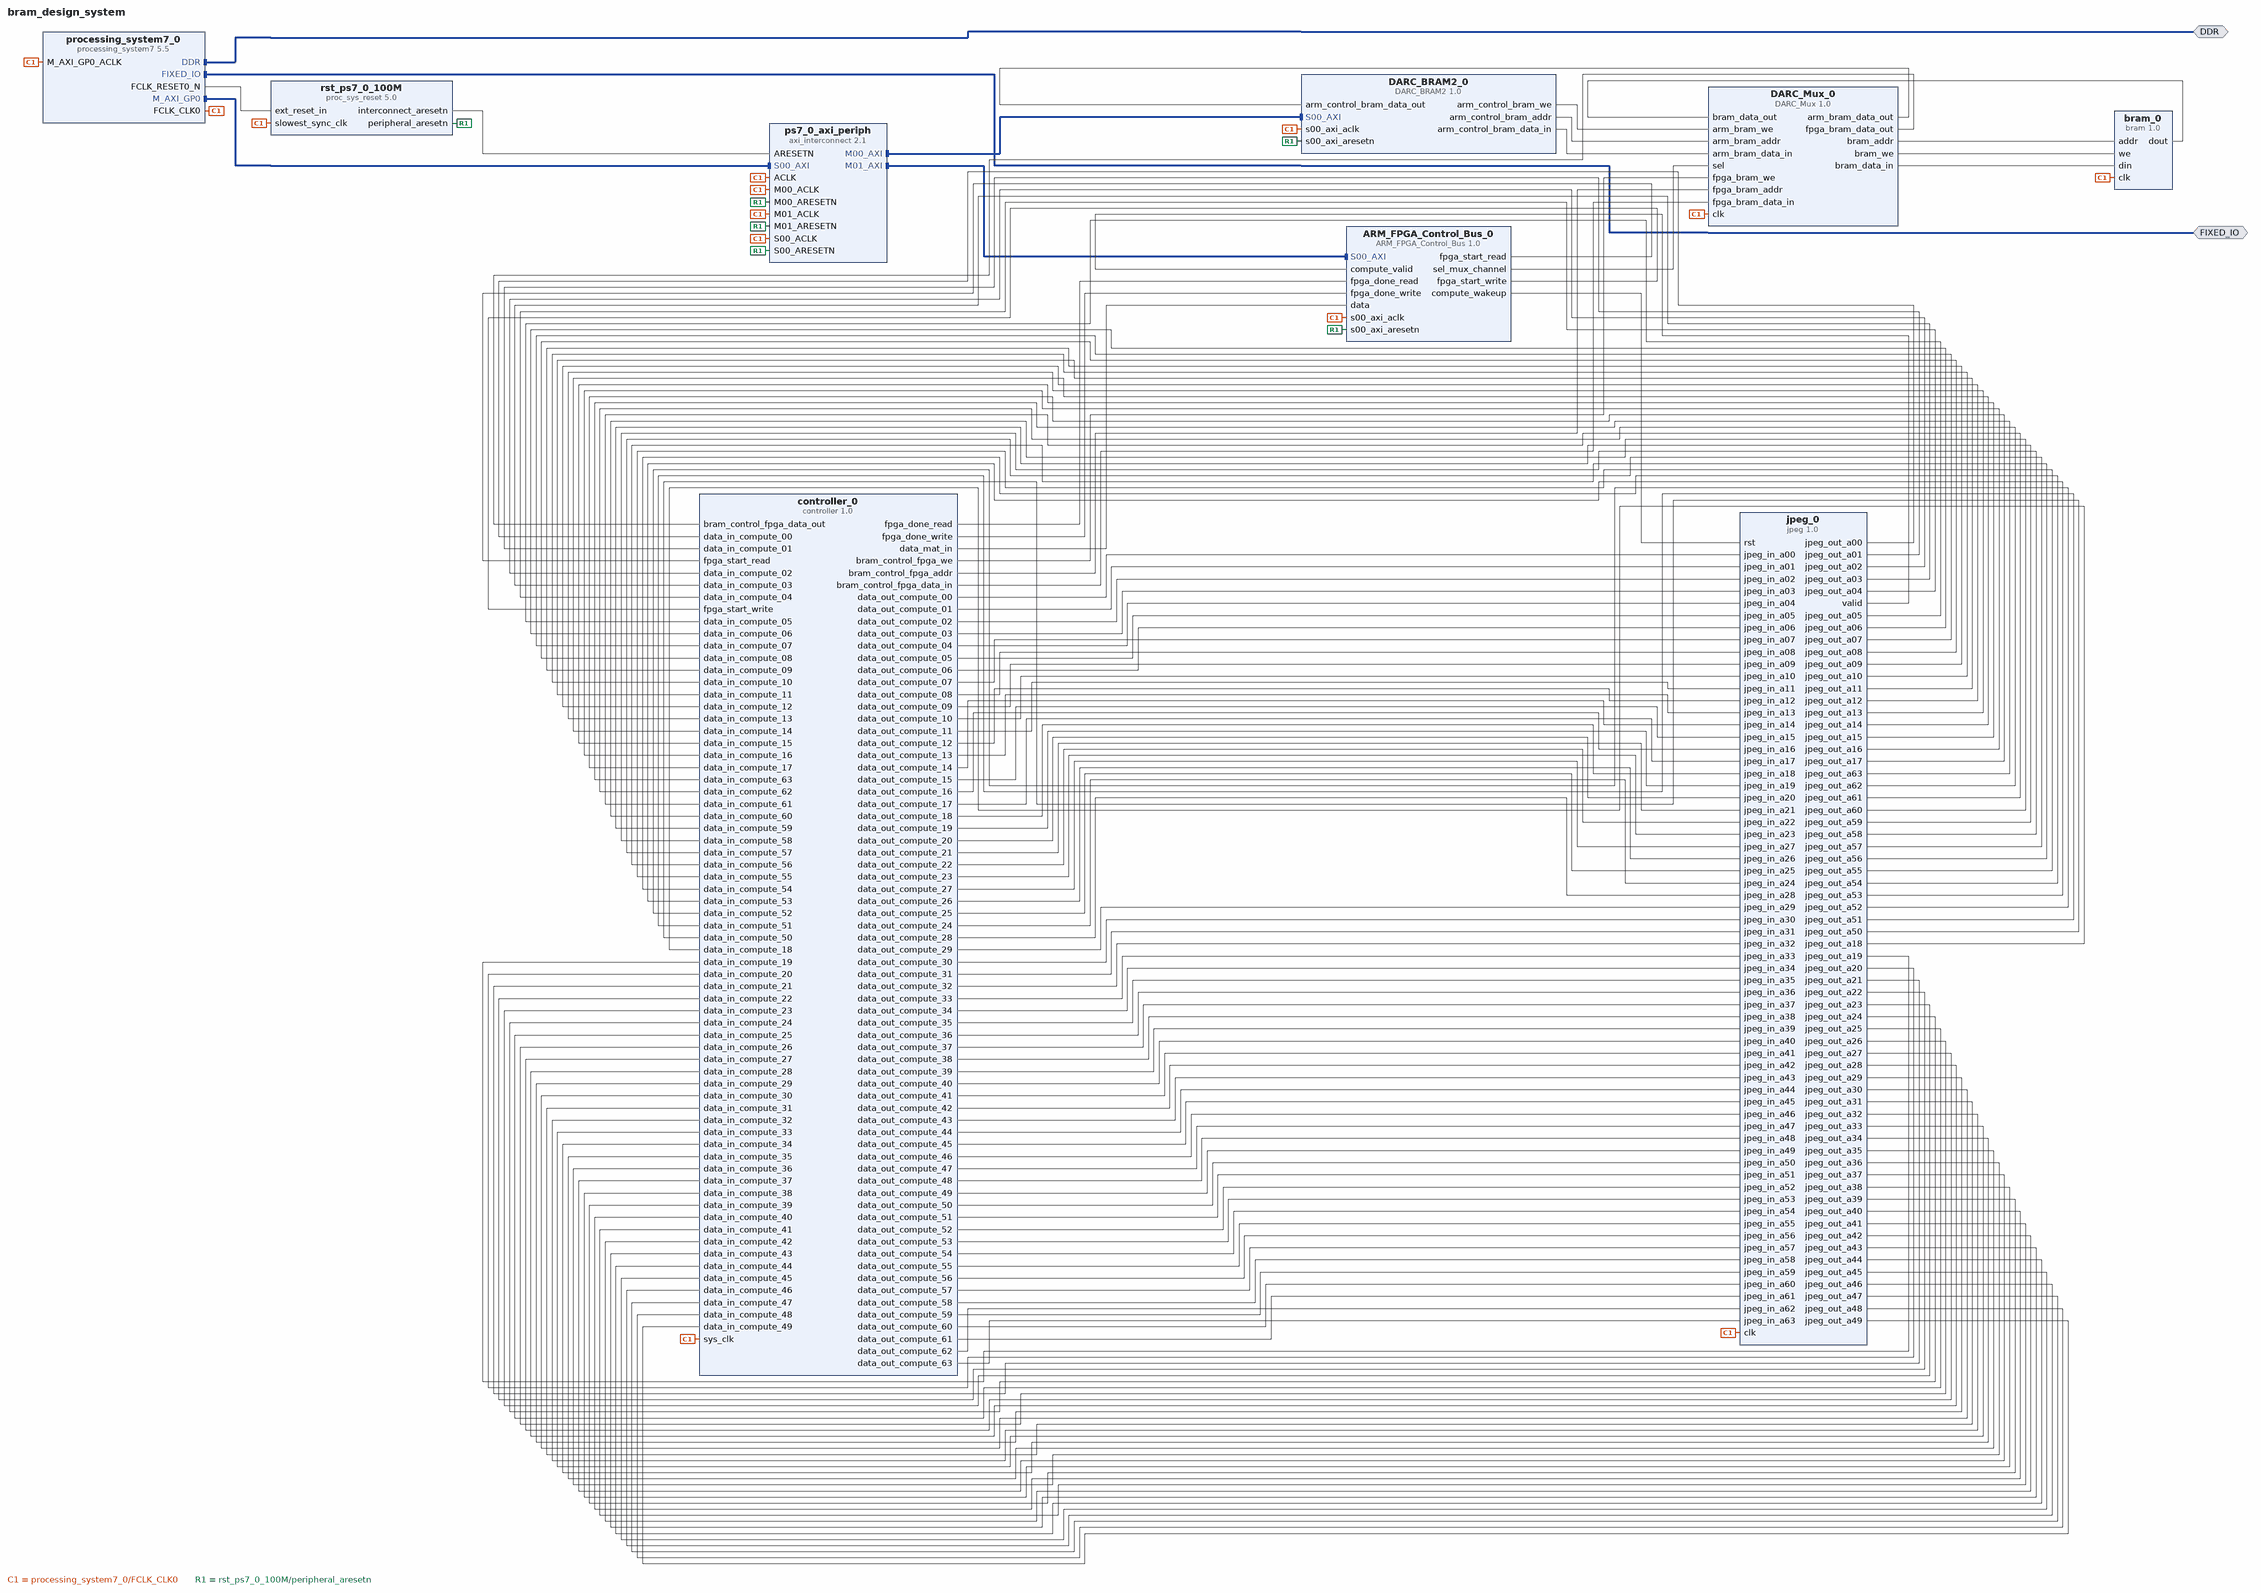
[diagram p0: block diagram of the top level]
# Vivado block design bram_design_system, xc7z020clg484-1, Vivado 2016.3
create_bd_design bram_design_system

create_bd_intf_port -mode Master -vlnv xilinx.com:interface:ddrx_rtl:1.0 DDR
create_bd_intf_port -mode Master -vlnv xilinx.com:display_processing_system7:fixedio_rtl:1.0 FIXED_IO

create_bd_cell -type ip -vlnv xilinx.com:ip:processing_system7:5.5 processing_system7_0
set_property -dict {CONFIG.PCW_FPGA0_PERIPHERAL_FREQMHZ 50 CONFIG.preset ZedBoard} [get_bd_cells processing_system7_0]
create_bd_cell -type ip -vlnv xilinx.com:ip:axi_interconnect:2.1 ps7_0_axi_periph
set_property -dict {CONFIG.NUM_MI 2} [get_bd_cells ps7_0_axi_periph]
create_bd_cell -type ip -vlnv xilinx.com:ip:proc_sys_reset:5.0 rst_ps7_0_100M
create_bd_cell -type ip -vlnv xilinx.com:user:DARC_BRAM2:1.0 DARC_BRAM2_0
create_bd_cell -type ip -vlnv xilinx.com:user:DARC_Mux:1.0 DARC_Mux_0
create_bd_cell -type ip -vlnv xilinx.com:user:bram:1.0 bram_0
create_bd_cell -type ip -vlnv xilinx.com:user:controller:1.0 controller_0
create_bd_cell -type ip -vlnv xilinx.com:user:jpeg:1.0 jpeg_0
create_bd_cell -type ip -vlnv xilinx.com:user:ARM_FPGA_Control_Bus:1.0 ARM_FPGA_Control_Bus_0

# ---- connections ----

connect_bd_intf_net [get_bd_intf_pins processing_system7_0/M_AXI_GP0] [get_bd_intf_pins ps7_0_axi_periph/S00_AXI]
connect_bd_intf_net [get_bd_intf_pins ps7_0_axi_periph/M00_AXI] [get_bd_intf_pins DARC_BRAM2_0/S00_AXI]
connect_bd_intf_net [get_bd_intf_pins ps7_0_axi_periph/M01_AXI] [get_bd_intf_pins ARM_FPGA_Control_Bus_0/S00_AXI]
connect_bd_intf_net [get_bd_intf_ports DDR] [get_bd_intf_pins processing_system7_0/DDR]
connect_bd_intf_net [get_bd_intf_ports FIXED_IO] [get_bd_intf_pins processing_system7_0/FIXED_IO]
connect_bd_net [get_bd_pins processing_system7_0/FCLK_CLK0] \
  [get_bd_pins processing_system7_0/M_AXI_GP0_ACLK] [get_bd_pins rst_ps7_0_100M/slowest_sync_clk] \
  [get_bd_pins DARC_BRAM2_0/s00_axi_aclk] [get_bd_pins DARC_Mux_0/clk] [get_bd_pins bram_0/clk] \
  [get_bd_pins ps7_0_axi_periph/S00_ACLK] [get_bd_pins ps7_0_axi_periph/ACLK] [get_bd_pins ps7_0_axi_periph/M00_ACLK] \
  [get_bd_pins ps7_0_axi_periph/M01_ACLK] [get_bd_pins controller_0/sys_clk] [get_bd_pins jpeg_0/clk] \
  [get_bd_pins ARM_FPGA_Control_Bus_0/s00_axi_aclk]
connect_bd_net [get_bd_pins processing_system7_0/FCLK_RESET0_N] [get_bd_pins rst_ps7_0_100M/ext_reset_in]
connect_bd_net [get_bd_pins rst_ps7_0_100M/peripheral_aresetn] \
  [get_bd_pins DARC_BRAM2_0/s00_axi_aresetn] [get_bd_pins ps7_0_axi_periph/S00_ARESETN] \
  [get_bd_pins ps7_0_axi_periph/M00_ARESETN] [get_bd_pins ps7_0_axi_periph/M01_ARESETN] \
  [get_bd_pins ARM_FPGA_Control_Bus_0/s00_axi_aresetn]
connect_bd_net [get_bd_pins rst_ps7_0_100M/interconnect_aresetn] [get_bd_pins ps7_0_axi_periph/ARESETN]
connect_bd_net [get_bd_pins DARC_Mux_0/bram_addr] [get_bd_pins bram_0/addr]
connect_bd_net [get_bd_pins DARC_Mux_0/bram_we] [get_bd_pins bram_0/we]
connect_bd_net [get_bd_pins DARC_Mux_0/bram_data_in] [get_bd_pins bram_0/din]
connect_bd_net [get_bd_pins bram_0/dout] [get_bd_pins DARC_Mux_0/bram_data_out]
connect_bd_net [get_bd_pins DARC_Mux_0/arm_bram_data_out] [get_bd_pins DARC_BRAM2_0/arm_control_bram_data_out]
connect_bd_net [get_bd_pins DARC_BRAM2_0/arm_control_bram_we] [get_bd_pins DARC_Mux_0/arm_bram_we]
connect_bd_net [get_bd_pins DARC_BRAM2_0/arm_control_bram_addr] [get_bd_pins DARC_Mux_0/arm_bram_addr]
connect_bd_net [get_bd_pins DARC_BRAM2_0/arm_control_bram_data_in] [get_bd_pins DARC_Mux_0/arm_bram_data_in]
connect_bd_net [get_bd_pins ARM_FPGA_Control_Bus_0/sel_mux_channel] [get_bd_pins DARC_Mux_0/sel]
connect_bd_net [get_bd_pins controller_0/bram_control_fpga_we] [get_bd_pins DARC_Mux_0/fpga_bram_we]
connect_bd_net [get_bd_pins controller_0/bram_control_fpga_addr] [get_bd_pins DARC_Mux_0/fpga_bram_addr]
connect_bd_net [get_bd_pins controller_0/bram_control_fpga_data_in] [get_bd_pins DARC_Mux_0/fpga_bram_data_in]
connect_bd_net [get_bd_pins ARM_FPGA_Control_Bus_0/fpga_start_read] [get_bd_pins controller_0/fpga_start_read]
connect_bd_net [get_bd_pins ARM_FPGA_Control_Bus_0/fpga_start_write] [get_bd_pins controller_0/fpga_start_write]
connect_bd_net [get_bd_pins controller_0/fpga_done_read] [get_bd_pins ARM_FPGA_Control_Bus_0/fpga_done_read]
connect_bd_net [get_bd_pins controller_0/fpga_done_write] [get_bd_pins ARM_FPGA_Control_Bus_0/fpga_done_write]
connect_bd_net [get_bd_pins DARC_Mux_0/fpga_bram_data_out] [get_bd_pins controller_0/bram_control_fpga_data_out]
connect_bd_net [get_bd_pins controller_0/data_mat_in] [get_bd_pins ARM_FPGA_Control_Bus_0/data]
connect_bd_net [get_bd_pins controller_0/data_out_compute_00] [get_bd_pins jpeg_0/jpeg_in_a00]
connect_bd_net [get_bd_pins controller_0/data_out_compute_01] [get_bd_pins jpeg_0/jpeg_in_a01]
connect_bd_net [get_bd_pins controller_0/data_out_compute_02] [get_bd_pins jpeg_0/jpeg_in_a02]
connect_bd_net [get_bd_pins controller_0/data_out_compute_03] [get_bd_pins jpeg_0/jpeg_in_a03]
connect_bd_net [get_bd_pins controller_0/data_out_compute_04] [get_bd_pins jpeg_0/jpeg_in_a04]
connect_bd_net [get_bd_pins controller_0/data_out_compute_05] [get_bd_pins jpeg_0/jpeg_in_a05]
connect_bd_net [get_bd_pins controller_0/data_out_compute_06] [get_bd_pins jpeg_0/jpeg_in_a06]
connect_bd_net [get_bd_pins controller_0/data_out_compute_07] [get_bd_pins jpeg_0/jpeg_in_a07]
connect_bd_net [get_bd_pins controller_0/data_out_compute_08] [get_bd_pins jpeg_0/jpeg_in_a08]
connect_bd_net [get_bd_pins controller_0/data_out_compute_09] [get_bd_pins jpeg_0/jpeg_in_a09]
connect_bd_net [get_bd_pins controller_0/data_out_compute_10] [get_bd_pins jpeg_0/jpeg_in_a10]
connect_bd_net [get_bd_pins controller_0/data_out_compute_11] [get_bd_pins jpeg_0/jpeg_in_a11]
connect_bd_net [get_bd_pins controller_0/data_out_compute_12] [get_bd_pins jpeg_0/jpeg_in_a12]
connect_bd_net [get_bd_pins controller_0/data_out_compute_13] [get_bd_pins jpeg_0/jpeg_in_a13]
connect_bd_net [get_bd_pins controller_0/data_out_compute_14] [get_bd_pins jpeg_0/jpeg_in_a14]
connect_bd_net [get_bd_pins controller_0/data_out_compute_15] [get_bd_pins jpeg_0/jpeg_in_a15]
connect_bd_net [get_bd_pins controller_0/data_out_compute_16] [get_bd_pins jpeg_0/jpeg_in_a16]
connect_bd_net [get_bd_pins controller_0/data_out_compute_17] [get_bd_pins jpeg_0/jpeg_in_a17]
connect_bd_net [get_bd_pins controller_0/data_out_compute_18] [get_bd_pins jpeg_0/jpeg_in_a18]
connect_bd_net [get_bd_pins controller_0/data_out_compute_19] [get_bd_pins jpeg_0/jpeg_in_a19]
connect_bd_net [get_bd_pins controller_0/data_out_compute_20] [get_bd_pins jpeg_0/jpeg_in_a20]
connect_bd_net [get_bd_pins controller_0/data_out_compute_21] [get_bd_pins jpeg_0/jpeg_in_a21]
connect_bd_net [get_bd_pins controller_0/data_out_compute_22] [get_bd_pins jpeg_0/jpeg_in_a22]
connect_bd_net [get_bd_pins controller_0/data_out_compute_23] [get_bd_pins jpeg_0/jpeg_in_a23]
connect_bd_net [get_bd_pins controller_0/data_out_compute_27] [get_bd_pins jpeg_0/jpeg_in_a27]
connect_bd_net [get_bd_pins controller_0/data_out_compute_26] [get_bd_pins jpeg_0/jpeg_in_a26]
connect_bd_net [get_bd_pins controller_0/data_out_compute_25] [get_bd_pins jpeg_0/jpeg_in_a25]
connect_bd_net [get_bd_pins controller_0/data_out_compute_24] [get_bd_pins jpeg_0/jpeg_in_a24]
connect_bd_net [get_bd_pins controller_0/data_out_compute_28] [get_bd_pins jpeg_0/jpeg_in_a28]
connect_bd_net [get_bd_pins controller_0/data_out_compute_29] [get_bd_pins jpeg_0/jpeg_in_a29]
connect_bd_net [get_bd_pins controller_0/data_out_compute_30] [get_bd_pins jpeg_0/jpeg_in_a30]
connect_bd_net [get_bd_pins controller_0/data_out_compute_31] [get_bd_pins jpeg_0/jpeg_in_a31]
connect_bd_net [get_bd_pins controller_0/data_out_compute_32] [get_bd_pins jpeg_0/jpeg_in_a32]
connect_bd_net [get_bd_pins controller_0/data_out_compute_33] [get_bd_pins jpeg_0/jpeg_in_a33]
connect_bd_net [get_bd_pins controller_0/data_out_compute_34] [get_bd_pins jpeg_0/jpeg_in_a34]
connect_bd_net [get_bd_pins controller_0/data_out_compute_35] [get_bd_pins jpeg_0/jpeg_in_a35]
connect_bd_net [get_bd_pins controller_0/data_out_compute_36] [get_bd_pins jpeg_0/jpeg_in_a36]
connect_bd_net [get_bd_pins controller_0/data_out_compute_37] [get_bd_pins jpeg_0/jpeg_in_a37]
connect_bd_net [get_bd_pins controller_0/data_out_compute_38] [get_bd_pins jpeg_0/jpeg_in_a38]
connect_bd_net [get_bd_pins controller_0/data_out_compute_39] [get_bd_pins jpeg_0/jpeg_in_a39]
connect_bd_net [get_bd_pins controller_0/data_out_compute_40] [get_bd_pins jpeg_0/jpeg_in_a40]
connect_bd_net [get_bd_pins controller_0/data_out_compute_41] [get_bd_pins jpeg_0/jpeg_in_a41]
connect_bd_net [get_bd_pins controller_0/data_out_compute_42] [get_bd_pins jpeg_0/jpeg_in_a42]
connect_bd_net [get_bd_pins controller_0/data_out_compute_43] [get_bd_pins jpeg_0/jpeg_in_a43]
connect_bd_net [get_bd_pins controller_0/data_out_compute_44] [get_bd_pins jpeg_0/jpeg_in_a44]
connect_bd_net [get_bd_pins controller_0/data_out_compute_45] [get_bd_pins jpeg_0/jpeg_in_a45]
connect_bd_net [get_bd_pins controller_0/data_out_compute_46] [get_bd_pins jpeg_0/jpeg_in_a46]
connect_bd_net [get_bd_pins controller_0/data_out_compute_47] [get_bd_pins jpeg_0/jpeg_in_a47]
connect_bd_net [get_bd_pins controller_0/data_out_compute_48] [get_bd_pins jpeg_0/jpeg_in_a48]
connect_bd_net [get_bd_pins controller_0/data_out_compute_49] [get_bd_pins jpeg_0/jpeg_in_a49]
connect_bd_net [get_bd_pins controller_0/data_out_compute_50] [get_bd_pins jpeg_0/jpeg_in_a50]
connect_bd_net [get_bd_pins controller_0/data_out_compute_51] [get_bd_pins jpeg_0/jpeg_in_a51]
connect_bd_net [get_bd_pins controller_0/data_out_compute_52] [get_bd_pins jpeg_0/jpeg_in_a52]
connect_bd_net [get_bd_pins controller_0/data_out_compute_53] [get_bd_pins jpeg_0/jpeg_in_a53]
connect_bd_net [get_bd_pins controller_0/data_out_compute_54] [get_bd_pins jpeg_0/jpeg_in_a54]
connect_bd_net [get_bd_pins controller_0/data_out_compute_55] [get_bd_pins jpeg_0/jpeg_in_a55]
connect_bd_net [get_bd_pins controller_0/data_out_compute_56] [get_bd_pins jpeg_0/jpeg_in_a56]
connect_bd_net [get_bd_pins controller_0/data_out_compute_57] [get_bd_pins jpeg_0/jpeg_in_a57]
connect_bd_net [get_bd_pins controller_0/data_out_compute_58] [get_bd_pins jpeg_0/jpeg_in_a58]
connect_bd_net [get_bd_pins controller_0/data_out_compute_59] [get_bd_pins jpeg_0/jpeg_in_a59]
connect_bd_net [get_bd_pins controller_0/data_out_compute_60] [get_bd_pins jpeg_0/jpeg_in_a60]
connect_bd_net [get_bd_pins controller_0/data_out_compute_61] [get_bd_pins jpeg_0/jpeg_in_a61]
connect_bd_net [get_bd_pins controller_0/data_out_compute_62] [get_bd_pins jpeg_0/jpeg_in_a62]
connect_bd_net [get_bd_pins controller_0/data_out_compute_63] [get_bd_pins jpeg_0/jpeg_in_a63]
connect_bd_net [get_bd_pins jpeg_0/valid] [get_bd_pins ARM_FPGA_Control_Bus_0/compute_valid]
connect_bd_net [get_bd_pins jpeg_0/jpeg_out_a00] [get_bd_pins controller_0/data_in_compute_00]
connect_bd_net [get_bd_pins jpeg_0/jpeg_out_a01] [get_bd_pins controller_0/data_in_compute_01]
connect_bd_net [get_bd_pins jpeg_0/jpeg_out_a02] [get_bd_pins controller_0/data_in_compute_02]
connect_bd_net [get_bd_pins jpeg_0/jpeg_out_a03] [get_bd_pins controller_0/data_in_compute_03]
connect_bd_net [get_bd_pins jpeg_0/jpeg_out_a04] [get_bd_pins controller_0/data_in_compute_04]
connect_bd_net [get_bd_pins jpeg_0/jpeg_out_a05] [get_bd_pins controller_0/data_in_compute_05]
connect_bd_net [get_bd_pins jpeg_0/jpeg_out_a06] [get_bd_pins controller_0/data_in_compute_06]
connect_bd_net [get_bd_pins jpeg_0/jpeg_out_a07] [get_bd_pins controller_0/data_in_compute_07]
connect_bd_net [get_bd_pins jpeg_0/jpeg_out_a08] [get_bd_pins controller_0/data_in_compute_08]
connect_bd_net [get_bd_pins jpeg_0/jpeg_out_a09] [get_bd_pins controller_0/data_in_compute_09]
connect_bd_net [get_bd_pins jpeg_0/jpeg_out_a10] [get_bd_pins controller_0/data_in_compute_10]
connect_bd_net [get_bd_pins jpeg_0/jpeg_out_a11] [get_bd_pins controller_0/data_in_compute_11]
connect_bd_net [get_bd_pins jpeg_0/jpeg_out_a12] [get_bd_pins controller_0/data_in_compute_12]
connect_bd_net [get_bd_pins jpeg_0/jpeg_out_a13] [get_bd_pins controller_0/data_in_compute_13]
connect_bd_net [get_bd_pins jpeg_0/jpeg_out_a14] [get_bd_pins controller_0/data_in_compute_14]
connect_bd_net [get_bd_pins jpeg_0/jpeg_out_a15] [get_bd_pins controller_0/data_in_compute_15]
connect_bd_net [get_bd_pins jpeg_0/jpeg_out_a16] [get_bd_pins controller_0/data_in_compute_16]
connect_bd_net [get_bd_pins jpeg_0/jpeg_out_a17] [get_bd_pins controller_0/data_in_compute_17]
connect_bd_net [get_bd_pins jpeg_0/jpeg_out_a63] [get_bd_pins controller_0/data_in_compute_63]
connect_bd_net [get_bd_pins jpeg_0/jpeg_out_a62] [get_bd_pins controller_0/data_in_compute_62]
connect_bd_net [get_bd_pins jpeg_0/jpeg_out_a61] [get_bd_pins controller_0/data_in_compute_61]
connect_bd_net [get_bd_pins jpeg_0/jpeg_out_a60] [get_bd_pins controller_0/data_in_compute_60]
connect_bd_net [get_bd_pins jpeg_0/jpeg_out_a59] [get_bd_pins controller_0/data_in_compute_59]
connect_bd_net [get_bd_pins jpeg_0/jpeg_out_a58] [get_bd_pins controller_0/data_in_compute_58]
connect_bd_net [get_bd_pins jpeg_0/jpeg_out_a57] [get_bd_pins controller_0/data_in_compute_57]
connect_bd_net [get_bd_pins jpeg_0/jpeg_out_a56] [get_bd_pins controller_0/data_in_compute_56]
connect_bd_net [get_bd_pins jpeg_0/jpeg_out_a55] [get_bd_pins controller_0/data_in_compute_55]
connect_bd_net [get_bd_pins jpeg_0/jpeg_out_a54] [get_bd_pins controller_0/data_in_compute_54]
connect_bd_net [get_bd_pins jpeg_0/jpeg_out_a53] [get_bd_pins controller_0/data_in_compute_53]
connect_bd_net [get_bd_pins jpeg_0/jpeg_out_a52] [get_bd_pins controller_0/data_in_compute_52]
connect_bd_net [get_bd_pins jpeg_0/jpeg_out_a51] [get_bd_pins controller_0/data_in_compute_51]
connect_bd_net [get_bd_pins jpeg_0/jpeg_out_a50] [get_bd_pins controller_0/data_in_compute_50]
connect_bd_net [get_bd_pins jpeg_0/jpeg_out_a18] [get_bd_pins controller_0/data_in_compute_18]
connect_bd_net [get_bd_pins jpeg_0/jpeg_out_a19] [get_bd_pins controller_0/data_in_compute_19]
connect_bd_net [get_bd_pins jpeg_0/jpeg_out_a20] [get_bd_pins controller_0/data_in_compute_20]
connect_bd_net [get_bd_pins jpeg_0/jpeg_out_a21] [get_bd_pins controller_0/data_in_compute_21]
connect_bd_net [get_bd_pins jpeg_0/jpeg_out_a22] [get_bd_pins controller_0/data_in_compute_22]
connect_bd_net [get_bd_pins jpeg_0/jpeg_out_a23] [get_bd_pins controller_0/data_in_compute_23]
connect_bd_net [get_bd_pins jpeg_0/jpeg_out_a24] [get_bd_pins controller_0/data_in_compute_24]
connect_bd_net [get_bd_pins jpeg_0/jpeg_out_a25] [get_bd_pins controller_0/data_in_compute_25]
connect_bd_net [get_bd_pins jpeg_0/jpeg_out_a26] [get_bd_pins controller_0/data_in_compute_26]
connect_bd_net [get_bd_pins jpeg_0/jpeg_out_a27] [get_bd_pins controller_0/data_in_compute_27]
connect_bd_net [get_bd_pins jpeg_0/jpeg_out_a28] [get_bd_pins controller_0/data_in_compute_28]
connect_bd_net [get_bd_pins jpeg_0/jpeg_out_a29] [get_bd_pins controller_0/data_in_compute_29]
connect_bd_net [get_bd_pins jpeg_0/jpeg_out_a30] [get_bd_pins controller_0/data_in_compute_30]
connect_bd_net [get_bd_pins jpeg_0/jpeg_out_a31] [get_bd_pins controller_0/data_in_compute_31]
connect_bd_net [get_bd_pins jpeg_0/jpeg_out_a32] [get_bd_pins controller_0/data_in_compute_32]
connect_bd_net [get_bd_pins jpeg_0/jpeg_out_a33] [get_bd_pins controller_0/data_in_compute_33]
connect_bd_net [get_bd_pins jpeg_0/jpeg_out_a34] [get_bd_pins controller_0/data_in_compute_34]
connect_bd_net [get_bd_pins jpeg_0/jpeg_out_a35] [get_bd_pins controller_0/data_in_compute_35]
connect_bd_net [get_bd_pins jpeg_0/jpeg_out_a36] [get_bd_pins controller_0/data_in_compute_36]
connect_bd_net [get_bd_pins jpeg_0/jpeg_out_a37] [get_bd_pins controller_0/data_in_compute_37]
connect_bd_net [get_bd_pins jpeg_0/jpeg_out_a38] [get_bd_pins controller_0/data_in_compute_38]
connect_bd_net [get_bd_pins jpeg_0/jpeg_out_a39] [get_bd_pins controller_0/data_in_compute_39]
connect_bd_net [get_bd_pins jpeg_0/jpeg_out_a40] [get_bd_pins controller_0/data_in_compute_40]
connect_bd_net [get_bd_pins jpeg_0/jpeg_out_a41] [get_bd_pins controller_0/data_in_compute_41]
connect_bd_net [get_bd_pins jpeg_0/jpeg_out_a42] [get_bd_pins controller_0/data_in_compute_42]
connect_bd_net [get_bd_pins jpeg_0/jpeg_out_a43] [get_bd_pins controller_0/data_in_compute_43]
connect_bd_net [get_bd_pins jpeg_0/jpeg_out_a44] [get_bd_pins controller_0/data_in_compute_44]
connect_bd_net [get_bd_pins jpeg_0/jpeg_out_a45] [get_bd_pins controller_0/data_in_compute_45]
connect_bd_net [get_bd_pins jpeg_0/jpeg_out_a46] [get_bd_pins controller_0/data_in_compute_46]
connect_bd_net [get_bd_pins jpeg_0/jpeg_out_a47] [get_bd_pins controller_0/data_in_compute_47]
connect_bd_net [get_bd_pins jpeg_0/jpeg_out_a48] [get_bd_pins controller_0/data_in_compute_48]
connect_bd_net [get_bd_pins jpeg_0/jpeg_out_a49] [get_bd_pins controller_0/data_in_compute_49]
connect_bd_net [get_bd_pins ARM_FPGA_Control_Bus_0/compute_wakeup] [get_bd_pins jpeg_0/rst]

# ---- address map ----
assign_bd_address -offset 0x43C00000 -range 64K -target_address_space [get_bd_addr_spaces processing_system7_0/Data] [get_bd_addr_segs DARC_BRAM2_0/S00_AXI/S00_AXI_reg]
assign_bd_address -offset 0x43C10000 -range 64K -target_address_space [get_bd_addr_spaces processing_system7_0/Data] [get_bd_addr_segs ARM_FPGA_Control_Bus_0/S00_AXI/S00_AXI_reg]

validate_bd_design
save_bd_design
